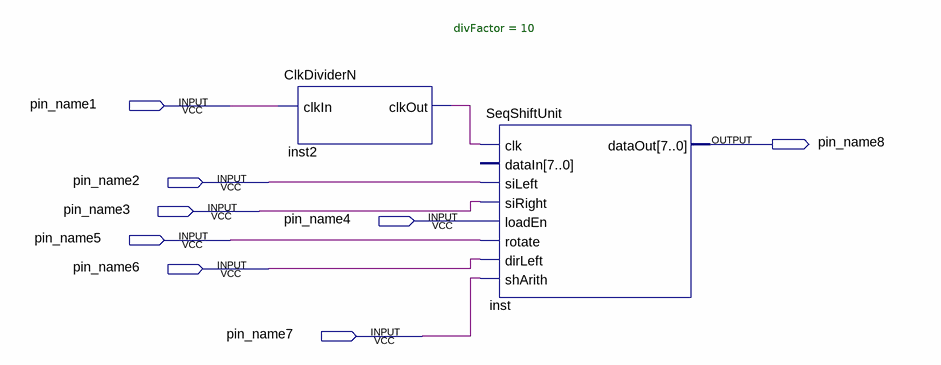
[diagram p0: schematic sheet]
// Quartus schematic SeqShiftUnit_Demo.bdf as structural Verilog: 2 symbols, 8 pins
module SeqShiftUnit_Demo (
  input  pin_name1,
  input  pin_name2,
  input  pin_name3,
  input  pin_name4,
  input  pin_name5,
  input  pin_name6,
  input  pin_name7,
  output pin_name8
);

  wire inst2_clkout;

  ClkDividerN #(.divFactor(10)) inst2 (.clkIn(pin_name1), .clkOut(inst2_clkout));
  SeqShiftUnit inst (
    .clk(inst2_clkout), .siLeft(pin_name2), .siRight(pin_name3), .loadEn(pin_name4), .rotate(pin_name5),
    .dirLeft(pin_name6), .shArith(pin_name7), .dataOut(pin_name8));  // open: dataIn
endmodule
